# EAGLE schematic 5409057 (EAGLE 6.6.0)

## Sheet 1 of 3
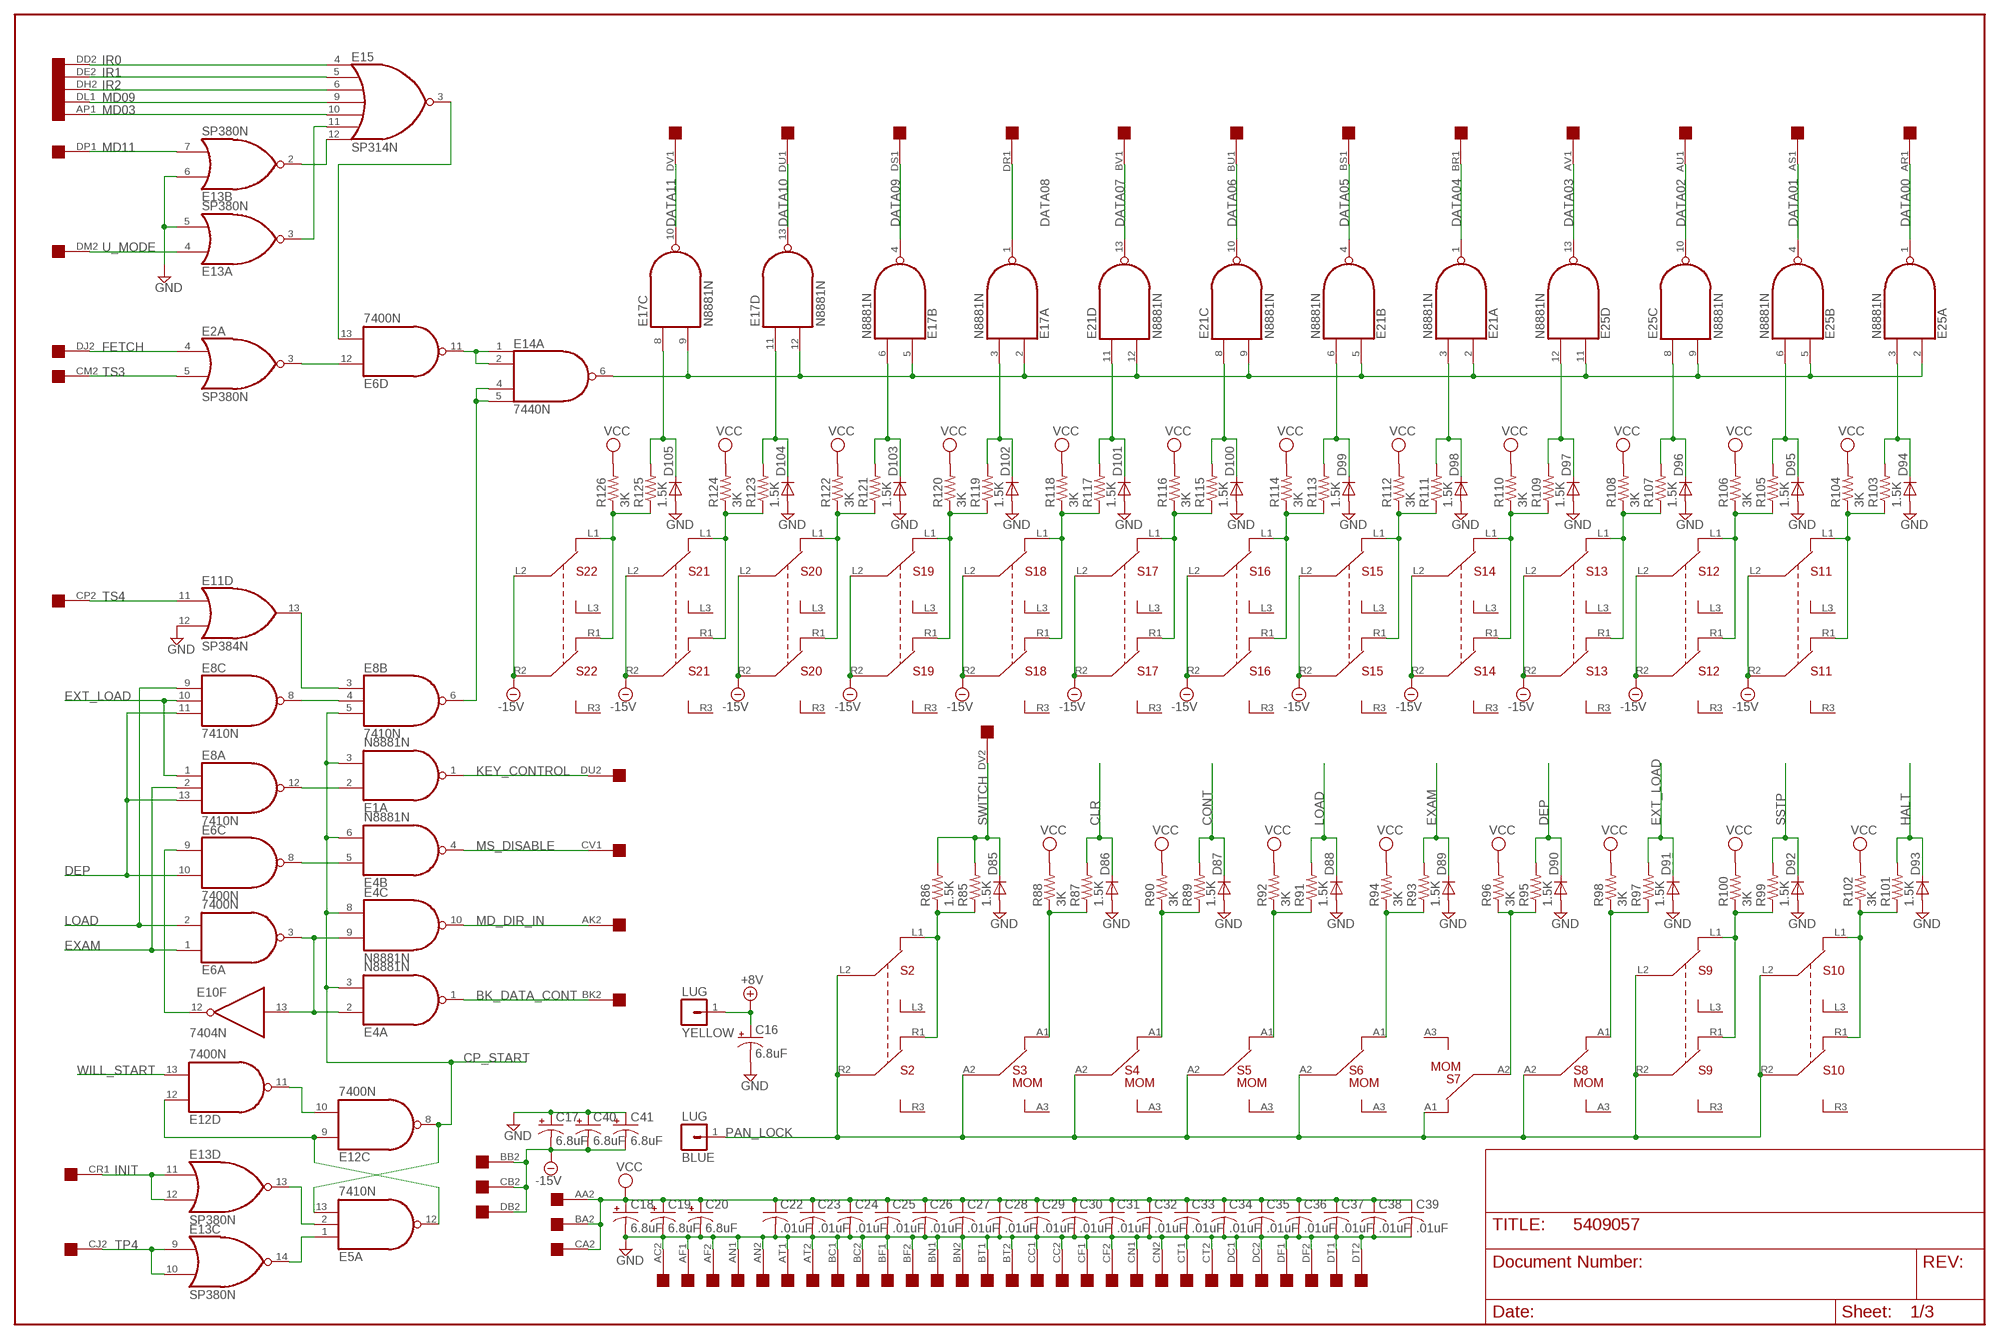
[diagram p0: schematic, sheet 1]

### Parts
BLUE  LUG  [SPADELUG]
C16  6.8uF  CPOL-USE20-8AXIAL  [E12-8]
C17  6.8uF  CPOL-USE20-8AXIAL  [E12-8]
C18  6.8uF  CPOL-USE20-8AXIAL  [E12-8]
C19  6.8uF  CPOL-USE20-8AXIAL  [E12-8]
C20  6.8uF  CPOL-USE20-8AXIAL  [E12-8]
C22  .01uF  C-US050-025X075  [C050-025X075]
C23  .01uF  C-US050-025X075  [C050-025X075]
C24  .01uF  C-US050-025X075  [C050-025X075]
C25  .01uF  C-US050-025X075  [C050-025X075]
C26  .01uF  C-US050-025X075  [C050-025X075]
C27  .01uF  C-US050-025X075  [C050-025X075]
C28  .01uF  C-US050-025X075  [C050-025X075]
C29  .01uF  C-US050-025X075  [C050-025X075]
C30  .01uF  C-US050-025X075  [C050-025X075]
C31  .01uF  C-US050-025X075  [C050-025X075]
C32  .01uF  C-US050-025X075  [C050-025X075]
C33  .01uF  C-US050-025X075  [C050-025X075]
C34  .01uF  C-US050-025X075  [C050-025X075]
C35  .01uF  C-US050-025X075  [C050-025X075]
C36  .01uF  C-US050-025X075  [C050-025X075]
C37  .01uF  C-US050-025X075  [C050-025X075]
C38  .01uF  C-US050-025X075  [C050-025X075]
C39  .01uF  C-US050-025X075  [C050-025X075]
C40  6.8uF  CPOL-USE20-8AXIAL  [E12-8]
C41  6.8uF  CPOL-USE20-8AXIAL  [E12-8]
D85  1N4148  [DO35-10]
D86  1N4148  [DO35-10]
D87  1N4148  [DO35-10]
D88  1N4148  [DO35-10]
D89  1N4148  [DO35-10]
D90  1N4148  [DO35-10]
D91  1N4148  [DO35-10]
D92  1N4148  [DO35-10]
D93  1N4148  [DO35-10]
D94  1N4148  [DO35-10]
D95  1N4148  [DO35-10]
D96  1N4148  [DO35-10]
D97  1N4148  [DO35-10]
D98  1N4148  [DO35-10]
D99  1N4148  [DO35-10]
D100  1N4148  [DO35-10]
D101  1N4148  [DO35-10]
D102  1N4148  [DO35-10]
D103  1N4148  [DO35-10]
D104  1N4148  [DO35-10]
D105  1N4148  [DO35-10]
E1  N8881N  [DIL14]
E2  SP380N  [DIL14]
E4  N8881N  [DIL14]
E5  7410N  [DIL14]
E6  7400N  [DIL14]
E8  7410N  [DIL14]
E10  7404N  [DIL14]
E11  SP384N  [DIL14]
E12  7400N  [DIL14]
E13  SP380N  [DIL14]
E14  7440N  74S20N  [DIL14]
E15  SP314N  [DIL14]
E17  N8881N  [DIL14]
E21  N8881N  [DIL14]
E25  N8881N  [DIL14]
R85  1.5K  R-US_0207/10  [0207/10]
R86  1.5K  R-US_0207/10  [0207/10]
R87  1.5K  R-US_0207/10  [0207/10]
R88  3K  R-US_0207/10  [0207/10]
R89  1.5K  R-US_0207/10  [0207/10]
R90  3K  R-US_0207/10  [0207/10]
R91  1.5K  R-US_0207/10  [0207/10]
R92  3K  R-US_0207/10  [0207/10]
R93  1.5K  R-US_0207/10  [0207/10]
R94  3K  R-US_0207/10  [0207/10]
R95  1.5K  R-US_0207/10  [0207/10]
R96  3K  R-US_0207/10  [0207/10]
R97  1.5K  R-US_0207/10  [0207/10]
R98  3K  R-US_0207/10  [0207/10]
R99  1.5K  R-US_0207/10  [0207/10]
R100  3K  R-US_0207/10  [0207/10]
R101  1.5K  R-US_0207/10  [0207/10]
R102  3K  R-US_0207/10  [0207/10]
R103  1.5K  R-US_0207/10  [0207/10]
R104  3K  R-US_0207/10  [0207/10]
R105  1.5K  R-US_0207/10  [0207/10]
R106  3K  R-US_0207/10  [0207/10]
R107  1.5K  R-US_0207/10  [0207/10]
R108  3K  R-US_0207/10  [0207/10]
R109  1.5K  R-US_0207/10  [0207/10]
R110  3K  R-US_0207/10  [0207/10]
R111  1.5K  R-US_0207/10  [0207/10]
R112  3K  R-US_0207/10  [0207/10]
R113  1.5K  R-US_0207/10  [0207/10]
R114  3K  R-US_0207/10  [0207/10]
R115  1.5K  R-US_0207/10  [0207/10]
R116  3K  R-US_0207/10  [0207/10]
R117  1.5K  R-US_0207/10  [0207/10]
R118  3K  R-US_0207/10  [0207/10]
R119  1.5K  R-US_0207/10  [0207/10]
R120  3K  R-US_0207/10  [0207/10]
R121  1.5K  R-US_0207/10  [0207/10]
R122  3K  R-US_0207/10  [0207/10]
R123  1.5K  R-US_0207/10  [0207/10]
R124  3K  R-US_0207/10  [0207/10]
R125  1.5K  R-US_0207/10  [0207/10]
R126  3K  R-US_0207/10  [0207/10]
S2  DPDT8I  [DPDT8I]
S3  SPDT8I  [SPDT8I]
S4  SPDT8I  [SPDT8I]
S5  SPDT8I  [SPDT8I]
S6  SPDT8I  [SPDT8I]
S7  SPDT8I  [SPDT8I]
S8  SPDT8I  [SPDT8I]
S9  DPDT8I  [DPDT8I]
S10  DPDT8I  [DPDT8I]
S11  DPDT8I  [DPDT8I]
S12  DPDT8I  [DPDT8I]
S13  DPDT8I  [DPDT8I]
S14  DPDT8I  [DPDT8I]
S15  DPDT8I  [DPDT8I]
S16  DPDT8I  [DPDT8I]
S17  DPDT8I  [DPDT8I]
S18  DPDT8I  [DPDT8I]
S19  DPDT8I  [DPDT8I]
S20  DPDT8I  [DPDT8I]
S21  DPDT8I  [DPDT8I]
S22  DPDT8I  [DPDT8I]
U$2  QUAD  [EDGE-CON8]
YELLOW  LUG  [SPADELUG]

### Nets
+8V [Supply]: C16.+ YELLOW.1 ; also sheet 2,3
-15V [Supply]: C17.- C40.- C41.- S11.L2(A2) S11.R2(B2) S12.L2(A2) S12.R2(B2) S13.L2(A2) S13.R2(B2) S14.L2(A2) S14.R2(B2) S15.L2(A2) S15.R2(B2) S16.L2(A2) S16.R2(B2) S17.L2(A2) S17.R2(B2) S18.L2(A2) S18.R2(B2) S19.L2(A2) S19.R2(B2) S20.L2(A2) S20.R2(B2) S21.L2(A2) S21.R2(B2) S22.L2(A2) S22.R2(B2) U$2.BB2 U$2.CB2 U$2.DB2 ; also sheet 2
BK_DATA_CONT: E4.1(A:O) U$2.BK2 ; also sheet 3
CLR: D86.C R87.2 ; also sheet 2
CONT: D87.C R89.2 ; also sheet 2
CP_START: E1.3(A:I1) E4.3(A:I1) E4.6(B:I1) E4.8(C:I0) E5.13(A:I2) E8.5(B:I2) E12.8(C:O) ; also sheet 2
DATA00: E25.1(A:O) U$2.AR1 ; also sheet 3
DATA01: E25.4(B:O) U$2.AS1 ; also sheet 3
DATA02: E25.10(C:O) U$2.AU1 ; also sheet 3
DATA03: E25.13(D:O) U$2.AV1 ; also sheet 3
DATA04: E21.1(A:O) U$2.BR1 ; also sheet 3
DATA05: E21.4(B:O) U$2.BS1 ; also sheet 3
DATA06: E21.10(C:O) U$2.BU1 ; also sheet 3
DATA07: E21.13(D:O) U$2.BV1 ; also sheet 3
DATA08: E17.1(A:O) U$2.DR1 ; also sheet 3
DATA09: E17.4(B:O) U$2.DS1 ; also sheet 3
DATA10: E17.13(D:O) U$2.DU1 ; also sheet 3
DATA11: E17.10(C:O) U$2.DV1 ; also sheet 3
DEP: D90.C E6.10(C:I1) E8.11(C:I2) E8.13(A:I2) R95.2 ; also sheet 2
EXAM: D89.C E6.1(A:I0) E8.2(A:I1) R93.2 ; also sheet 2
EXT_LOAD: D91.C E8.1(A:I0) E8.10(C:I1) R97.2 ; also sheet 2
FETCH: E2.4(A:I0) U$2.DJ2 ; also sheet 3
GND [Supply]: C16.- C17.+ C18.- C19.- C20.- C22.2 C23.2 C24.2 C25.2 C26.2 C27.2 C28.2 C29.2 C30.2 C31.2 C32.2 C33.2 C34.2 C35.2 C36.2 C37.2 C38.2 C39.2 C40.+ C41.+ D85.A D86.A D87.A D88.A D89.A D90.A D91.A D92.A D93.A D94.A D95.A D96.A D97.A D98.A D99.A D100.A D101.A D102.A D103.A D104.A D105.A E11.12(D:I1) E13.5(A:I1) E13.6(B:I0) U$2.AC2 U$2.AF1 U$2.AF2 U$2.AN1 U$2.AN2 U$2.AT1 U$2.AT2 U$2.BC1 U$2.BC2 U$2.BF1 U$2.BF2 U$2.BN1 U$2.BN2 U$2.BT1 U$2.BT2 U$2.CC1 U$2.CC2 U$2.CF1 U$2.CF2 U$2.CN1 U$2.CN2 U$2.CT1 U$2.CT2 U$2.DC1 U$2.DC2 U$2.DF1 U$2.DF2 U$2.DT1 U$2.DT2 ; also sheet 2,3
HALT: D93.C R101.2 ; also sheet 2
INIT: E13.11(D:I0) E13.12(D:I1) U$2.CR1 ; also sheet 2
IR0: E15.4(I0) U$2.DD2 ; also sheet 3
IR1: E15.5(I1) U$2.DE2 ; also sheet 3
IR2: E15.6(I2) U$2.DH2 ; also sheet 3
KEY_CONTROL: E1.1(A:O) U$2.DU2
LOAD: D88.C E6.2(A:I1) E8.9(C:I0) R91.2 ; also sheet 2
MD03: E15.10(I4) U$2.AP1 ; also sheet 3
MD09: E15.9(I3) U$2.DL1 ; also sheet 3
MD11: E13.7(B:I1) U$2.DP1 ; also sheet 3
MD_DIR_IN: E4.10(C:O) U$2.AK2 ; also sheet 3
MS_DISABLE: E4.4(B:O) U$2.CV1
N$1: E13.3(A:O) E15.11(I5)
N$2: E13.2(B:O) E15.12(I6)
N$3: E6.13(D:I1) E15.3(O)
N$4: E2.3(A:O) E6.12(D:I0)
N$5: E6.11(D:O) E14.1(A:I0) E14.2(A:I1)
N$6: E8.3(B:I0) E11.13(D:O)
N$7: E14.6(A:O) E17.2(A:I0) E17.5(B:I0) E17.9(C:I1) E17.12(D:I1) E21.2(A:I0) E21.5(B:I0) E21.9(C:I1) E21.12(D:I1) E25.2(A:I0) E25.5(B:I0) E25.9(C:I1) E25.11(D:I0)
N$8: R125.1 R126.1 S22.L1(A1) S22.R1(B1)
N$9: R121.1 R122.1 S20.L1(A1) S20.R1(B1)
N$10: D105.C E17.8(C:I0) R125.2
N$11: R123.1 R124.1 S21.L1(A1) S21.R1(B1)
N$12: D103.C E17.6(B:I1) R121.2
N$13: R117.1 R118.1 S18.L1(A1) S18.R1(B1)
N$14: D104.C E17.11(D:I0) R123.2
N$15: R119.1 R120.1 S19.L1(A1) S19.R1(B1)
N$16: D101.C E21.11(D:I0) R117.2
N$17: R109.1 R110.1 S14.L1(A1) S14.R1(B1)
N$18: D102.C E17.3(A:I1) R119.2
N$19: R115.1 R116.1 S17.L1(A1) S17.R1(B1)
N$20: D97.C E25.12(D:I1) R109.2
N$21: R85.1 R86.1 S2.L1(A1) S2.R1(B1)
N$22: D100.C E21.8(C:I0) R115.2
N$23: R87.1 R88.1 S3.A1
N$24: R113.1 R114.1 S16.L1(A1) S16.R1(B1)
N$26: D99.C E21.6(B:I1) R113.2
N$27: R89.1 R90.1 S4.A1
N$28: R111.1 R112.1 S15.L1(A1) S15.R1(B1)
N$30: D98.C E21.3(A:I1) R111.2
N$31: R91.1 R92.1 S5.A1
N$32: R107.1 R108.1 S13.L1(A1) S13.R1(B1)
N$33: D96.C E25.8(C:I0) R107.2
N$34: R105.1 R106.1 S12.L1(A1) S12.R1(B1)
N$35: D95.C E25.6(B:I1) R105.2
N$36: R103.1 R104.1 S11.L1(A1) S11.R1(B1)
N$37: D94.C E25.3(A:I1) R103.2
N$38: E8.4(B:I1) E8.8(C:O)
N$39: R93.1 R94.1 S6.A1
N$40: E1.2(A:I0) E8.12(A:O)
N$41: R95.1 R96.1 S7.A2
N$42: E4.5(B:I0) E6.8(C:O)
N$43: R99.1 R100.1 S9.L1(A1) S9.R1(B1)
N$44: E4.2(A:I0) E4.9(C:I1) E6.3(A:O) E10.13(F:I)
N$45: R101.1 R102.1 S10.L1(A1) S10.R1(B1)
N$47: E6.9(C:I0) E10.12(F:O)
N$48: R97.1 R98.1 S8.A1
N$49: E8.6(B:O) E14.4(A:I2) E14.5(A:I3)
N$71: E5.2(A:I1) E13.13(D:O)
N$72: E5.1(A:I0) E13.14(C:O)
N$74: E5.12(A:O) E12.9(C:I0) E12.12(D:I0)
N$75: E12.10(C:I1) E12.11(D:O)
PAN_LOCK [Supply]: BLUE.1 S2.L2(A2) S2.R2(B2) S3.A2 S4.A2 S5.A2 S6.A2 S7.A1 S8.A2 S9.L2(A2) S9.R2(B2) S10.L2(A2) S10.R2(B2)
SSTP: D92.C R99.2 ; also sheet 2
SWITCH: D85.C R85.2 R86.2 U$2.DV2 ; also sheet 3
TP4: E13.9(C:I0) E13.10(C:I1) U$2.CJ2
TS3: E2.5(A:I1) U$2.CM2
TS4: E11.11(D:I0) U$2.CP2
U_MODE: E13.4(A:I0) U$2.DM2
VCC [Supply]: C18.+ C19.+ C20.+ C22.1 C23.1 C24.1 C25.1 C26.1 C27.1 C28.1 C29.1 C30.1 C31.1 C32.1 C33.1 C34.1 C35.1 C36.1 C37.1 C38.1 C39.1 R88.2 R90.2 R92.2 R94.2 R96.2 R98.2 R100.2 R102.2 R104.2 R106.2 R108.2 R110.2 R112.2 R114.2 R116.2 R118.2 R120.2 R122.2 R124.2 R126.2 U$2.AA2 U$2.BA2 U$2.CA2 ; also sheet 2,3
WILL_START: E12.13(D:I1) ; also sheet 2
Unconnected: E1.4(B:O) E1.5(B:I0) E1.6(B:I1) E1.8(C:I0) E1.9(C:I1) E1.10(C:O) E11.3(A:O) E11.4(A:I0) E11.5(A:I1) S2.L3(A3) S2.R3(B3) S3.A3 S4.A3 S5.A3 S6.A3 S7.A3 S8.A3 S9.L3(A3) S9.R3(B3) S10.L3(A3) S10.R3(B3) S11.L3(A3) S11.R3(B3) S12.L3(A3) S12.R3(B3) S13.L3(A3) S13.R3(B3) S14.L3(A3) S14.R3(B3) S15.L3(A3) S15.R3(B3) S16.L3(A3) S16.R3(B3) S17.L3(A3) S17.R3(B3) S18.L3(A3) S18.R3(B3) S19.L3(A3) S19.R3(B3) S20.L3(A3) S20.R3(B3) S21.L3(A3) S21.R3(B3) S22.L3(A3) S22.R3(B3) U$2.AA1 U$2.AB1 U$2.AB2 U$2.AC1 U$2.AL2 U$2.AM2 U$2.AP2 U$2.AR2 U$2.AS2 U$2.AU2 U$2.AV2 U$2.BA1 U$2.BB1 U$2.BD2 U$2.BH2 U$2.BJ2 U$2.BP2 U$2.BR2 U$2.BS2 U$2.BV2 U$2.CA1 U$2.CB1 U$2.CD2 U$2.CE1 U$2.CE2 U$2.CH1 U$2.CH2 U$2.CJ1 U$2.CK1 U$2.CL1 U$2.CL2 U$2.CM1 U$2.CP1 U$2.CR2 U$2.CS1 U$2.CS2 U$2.CU1 U$2.DA1 U$2.DA2 U$2.DB1 U$2.DN1 U$2.DN2

## Sheet 2 of 3
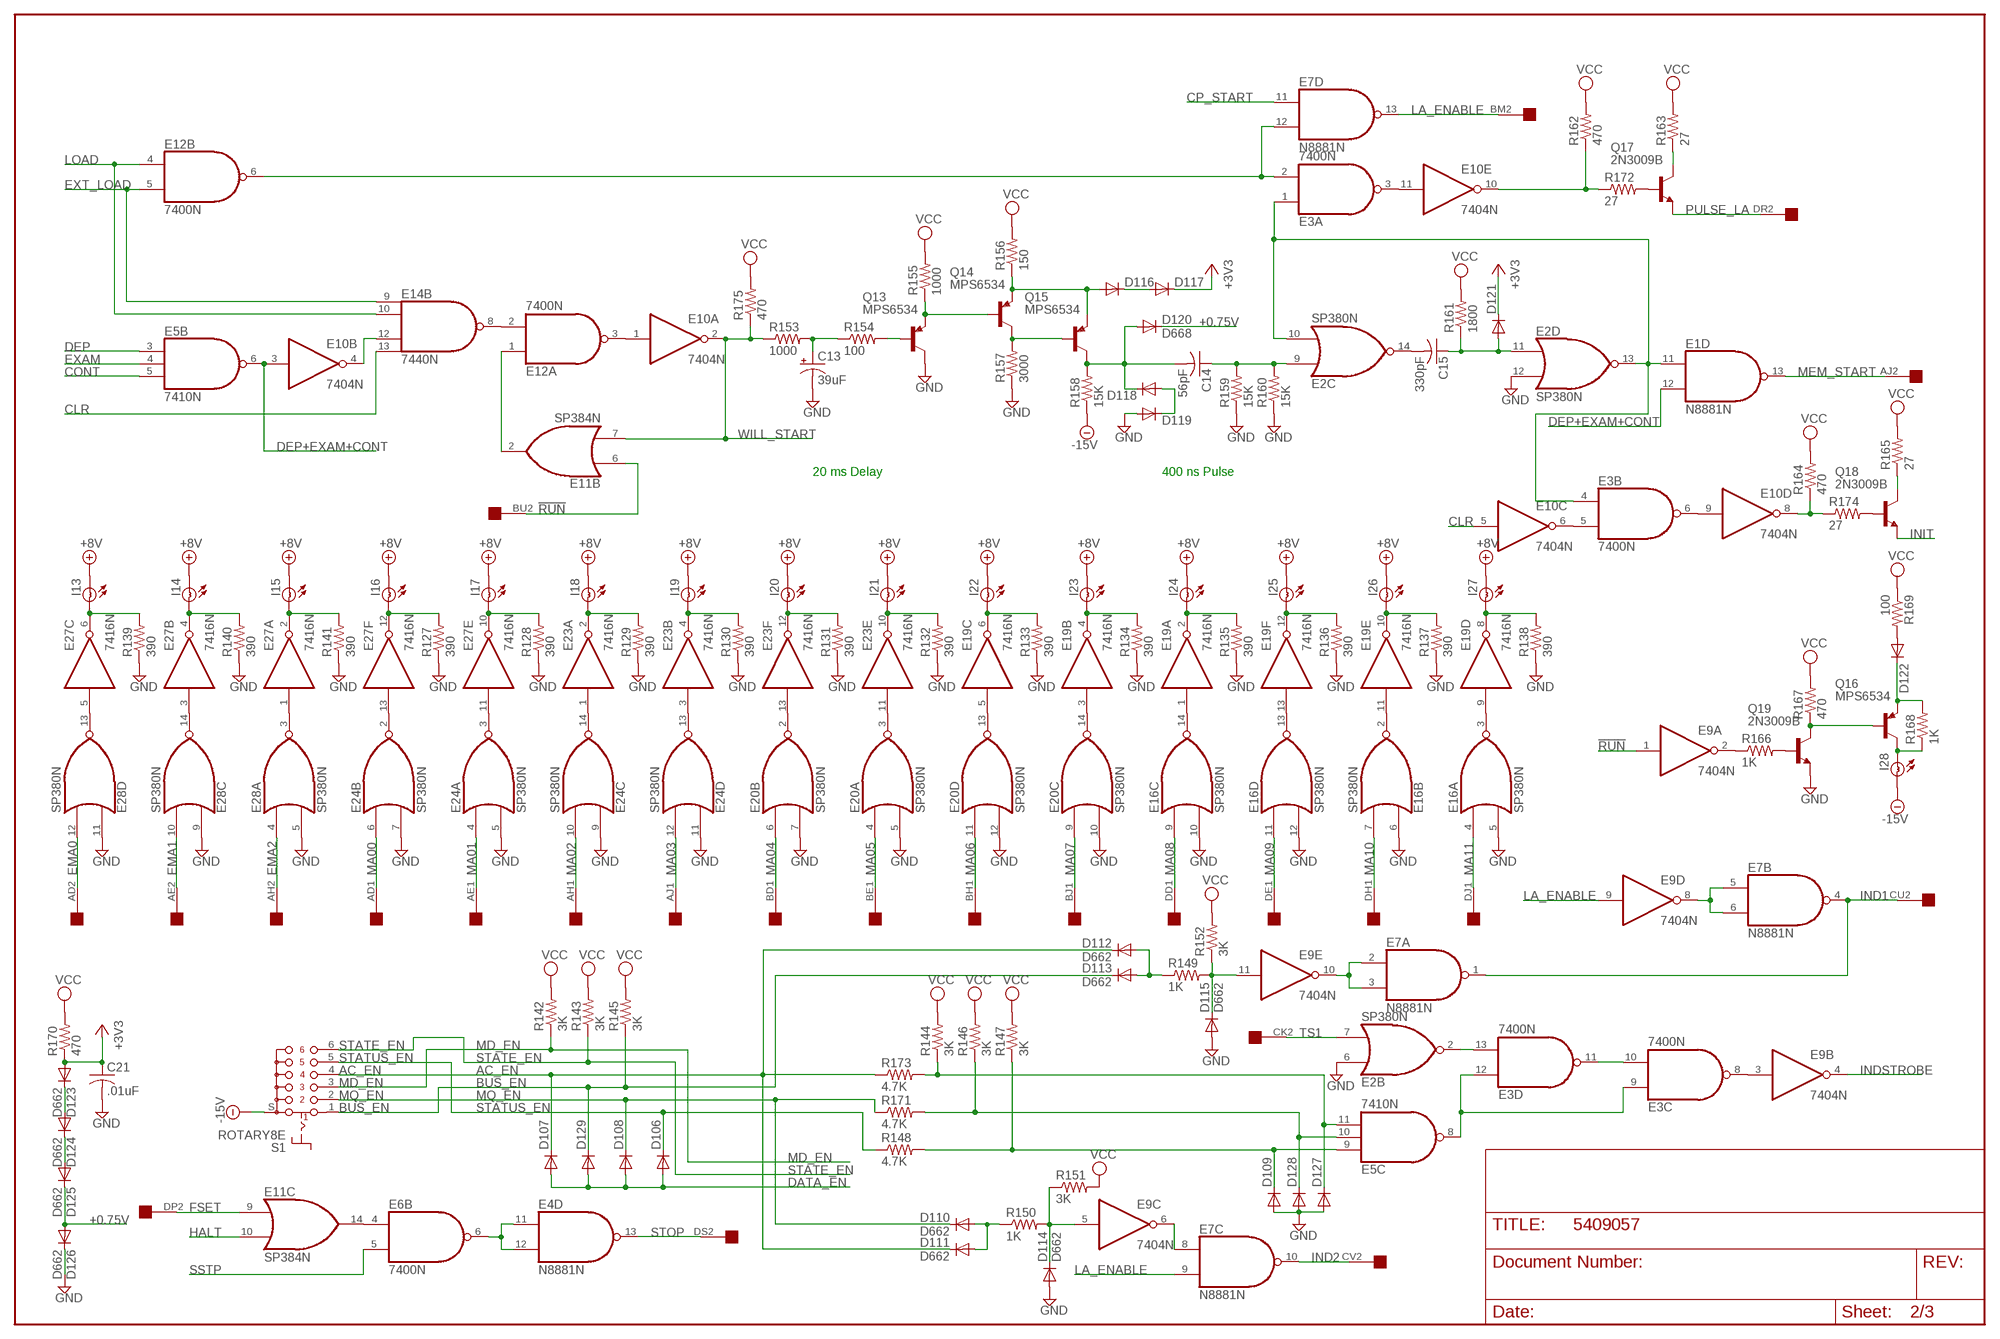
[diagram p1: schematic, sheet 2]

### Parts
C13  39uF  CPOL-USE20-8AXIAL  [E12-8]
C14  56pF  C-US050-025X075  [C050-025X075]
C15  330pF  C-US050-025X075  [C050-025X075]
C21  .01uF  C-US050-025X075  [C050-025X075]
D106  1N4148  [DO35-10]
D107  1N4148  [DO35-10]
D108  1N4148  [DO35-10]
D109  1N4148  [DO35-10]
D110  D662  1N4148  [DO35-10]
D111  D662  1N4148  [DO35-10]
D112  D662  1N4148  [DO35-10]
D113  D662  1N4148  [DO35-10]
D114  D662  1N4148  [DO35-10]
D115  D662  1N4148  [DO35-10]
D116  1N4148  [DO35-10]
D117  1N4148  [DO35-10]
D118  1N4148  [DO35-10]
D119  1N4148  [DO35-10]
D120  D668  1N4148  [DO35-10]
D121  1N4148  [DO35-10]
D122  1N4148  [DO35-10]
D123  D662  1N4148  [DO35-10]
D124  D662  1N4148  [DO35-10]
D125  D662  1N4148  [DO35-10]
D126  D662  1N4148  [DO35-10]
D127  1N4148  [DO35-10]
D128  1N4148  [DO35-10]
D129  1N4148  [DO35-10]
E3  7400N  [DIL14]
E7  N8881N  [DIL14]
E9  7404N  [DIL14]
E16  SP380N  [DIL14]
E19  7416N  [DIL14]
E20  SP380N  [DIL14]
E23  7416N  [DIL14]
E24  SP380N  [DIL14]
E27  7416N  [DIL14]
E28  SP380N  [DIL14]
I13  BULB  [BULB]
I14  BULB  [BULB]
I15  BULB  [BULB]
I16  BULB  [BULB]
I17  BULB  [BULB]
I18  BULB  [BULB]
I19  BULB  [BULB]
I20  BULB  [BULB]
I21  BULB  [BULB]
I22  BULB  [BULB]
I23  BULB  [BULB]
I24  BULB  [BULB]
I25  BULB  [BULB]
I26  BULB  [BULB]
I27  BULB  [BULB]
I28  BULB  [BULB]
Q13  MPS6534  2N3637  [TO39]
Q14  MPS6534  2N3637  [TO39]
Q15  MPS6534  2N3637  [TO39]
Q16  MPS6534  2N3637  [TO39]
Q17  2N3009B  2N3019  [TO39]
Q18  2N3009B  2N3019  [TO39]
Q19  2N3009B  2N3019  [TO39]
R127  390  R-US_0207/10  [0207/10]
R128  390  R-US_0207/10  [0207/10]
R129  390  R-US_0207/10  [0207/10]
R130  390  R-US_0207/10  [0207/10]
R131  390  R-US_0207/10  [0207/10]
R132  390  R-US_0207/10  [0207/10]
R133  390  R-US_0207/10  [0207/10]
R134  390  R-US_0207/10  [0207/10]
R135  390  R-US_0207/10  [0207/10]
R136  390  R-US_0207/10  [0207/10]
R137  390  R-US_0207/10  [0207/10]
R138  390  R-US_0207/10  [0207/10]
R139  390  R-US_0207/10  [0207/10]
R140  390  R-US_0207/10  [0207/10]
R141  390  R-US_0207/10  [0207/10]
R142  3K  R-US_0207/10  [0207/10]
R143  3K  R-US_0207/10  [0207/10]
R144  3K  R-US_0207/10  [0207/10]
R145  3K  R-US_0207/10  [0207/10]
R146  3K  R-US_0207/10  [0207/10]
R147  3K  R-US_0207/10  [0207/10]
R148  4.7K  R-US_0207/10  [0207/10]
R149  1K  R-US_0207/10  [0207/10]
R150  1K  R-US_0207/10  [0207/10]
R151  3K  R-US_0207/10  [0207/10]
R152  3K  R-US_0207/10  [0207/10]
R153  1000  R-US_0207/10  [0207/10]
R154  100  R-US_0207/10  [0207/10]
R155  1000  R-US_0207/10  [0207/10]
R156  150  R-US_0207/10  [0207/10]
R157  3000  R-US_0207/10  [0207/10]
R158  15K  R-US_0207/10  [0207/10]
R159  15K  R-US_0207/10  [0207/10]
R160  15K  R-US_0207/10  [0207/10]
R161  1800  R-US_0207/10  [0207/10]
R162  470  R-US_0207/10  [0207/10]
R163  27  R-US_0207/10  [0207/10]
R164  470  R-US_0207/10  [0207/10]
R165  27  R-US_0207/10  [0207/10]
R166  1K  R-US_0207/10  [0207/10]
R167  470  R-US_0207/10  [0207/10]
R168  1K  R-US_0207/10  [0207/10]
R169  100  R-US_0207/10  [0207/10]
R170  470  R-US_0207/10  [0207/10]
R171  4.7K  R-US_0207/10  [0207/10]
R172  27  R-US_0207/10  [0207/10]
R173  4.7K  R-US_0207/10  [0207/10]
R174  27  R-US_0207/10  [0207/10]
R175  470  R-US_0204/7  [0204/7]
S1  ROTARY8E  [ROTARY-8E]

### Nets
!RUN: E9.1(A:I) E11.6(B:I0) U$2.BU2
+0.75V [Supply]: D120.C D125.C D126.A
+3V3: C21.1 D117.C D121.C D123.A R170.1
+8V [Supply]: I13.B I14.B I15.B I16.B I17.B I18.B I19.B I20.B I21.B I22.B I23.B I24.B I25.B I26.B I27.B ; also sheet 1,3
-15V [Supply]: I28.A R158.1 S1.S ; also sheet 1
AC_EN: D107.C D111.C D112.C R173.1 S1.4
BUS_EN: D113.C D129.C R145.1 S1.1
CLR: E10.5(C:I) E14.13(B:I3) ; also sheet 1
CONT: E5.5(B:I2) ; also sheet 1
CP_START: E7.11(D:I0) ; also sheet 1
DATA_EN: D106.A D107.A D108.A D129.A ; also sheet 3
DEP: E5.3(B:I0) ; also sheet 1
DEP+EXAM+CONT: E1.12(D:I1) E5.6(B:O) E10.3(B:I)
EMA0: E28.12(D:I1) U$2.AD2
EMA1: E28.10(C:I1) U$2.AE2
EMA2: E28.4(A:I0) U$2.AH2
EXAM: E5.4(B:I1) ; also sheet 1
EXT_LOAD: E12.5(B:I1) E14.9(B:I0) ; also sheet 1
FSET: E11.9(C:I0) U$2.DP2
GND [Supply]: C13.- C21.2 D109.A D114.A D115.A D119.A D126.C D127.A D128.A E2.6(B:I0) E2.12(D:I1) E16.5(A:I1) E16.6(B:I0) E16.10(C:I1) E16.12(D:I1) E20.5(A:I1) E20.7(B:I1) E20.10(C:I1) E20.12(D:I1) E24.5(A:I1) E24.7(B:I1) E24.9(C:I0) E24.11(D:I0) E28.5(A:I1) E28.9(C:I0) E28.11(D:I0) Q13.3(C) Q19.1(E) R127.1 R128.1 R129.1 R130.1 R131.1 R132.1 R133.1 R134.1 R135.1 R136.1 R137.1 R138.1 R139.1 R140.1 R141.1 R157.1 R159.1 R160.1 ; also sheet 1,3
HALT: E11.10(C:I1) ; also sheet 1
IND1: E7.1(A:O) E7.4(B:O) U$2.CU2
IND2: E7.10(C:O) U$2.CV2
INDSTROBE: E9.4(B:O) ; also sheet 3
INIT: Q18.1(E) ; also sheet 1
LA_ENABLE: E7.9(C:I1) E7.13(D:O) E9.9(D:I) U$2.BM2
LOAD: E12.4(B:I0) E14.10(B:I1) ; also sheet 1
MA00: E24.6(B:I0) U$2.AD1
MA01: E24.4(A:I0) U$2.AE1
MA02: E24.10(C:I1) U$2.AH1
MA03: E24.12(D:I1) U$2.AJ1
MA04: E20.6(B:I0) U$2.BD1
MA05: E20.4(A:I0) U$2.BE1
MA06: E20.11(D:I0) U$2.BH1
MA07: E20.9(C:I0) U$2.BJ1
MA08: E16.9(C:I0) U$2.DD1
MA09: E16.11(D:I0) U$2.DE1
MA10: E16.7(B:I1) U$2.DH1
MA11: E16.4(A:I0) U$2.DJ1
MD_EN: R142.1 S1.3 ; also sheet 3
MEM_START: E1.13(D:O) U$2.AJ2
MQ_EN: D108.C D110.C R171.1 S1.2
N$25: E27.10(E:O) I17.A R128.2
N$29: E10.4(B:O) E14.12(B:I2)
N$50: E12.2(A:I1) E14.8(B:O)
N$51: E10.1(A:I) E12.3(A:O)
N$52: E11.2(B:O) E12.1(A:I0)
N$54: C13.+ R153.2 R154.1
N$55: Q13.2(B) R154.2
N$56: Q13.1(E) Q14.2(B) R155.1
N$57: D116.A Q14.1(E) Q15.1(E) R156.1
N$58: Q14.3(C) Q15.2(B) R157.2
N$59: C14.2 D118.C D120.A Q15.3(C) R158.2
N$60: D116.C D117.A
N$61: C14.1 E2.9(C:I0) R159.2 R160.2
N$62: D118.A D119.C
N$63: C15.2 E2.14(C:O)
N$64: C15.1 D121.A E2.11(D:I0) R161.1
N$65: E1.11(D:I0) E2.10(C:I1) E2.13(D:O) E3.1(A:I0) E3.4(B:I0)
N$66: E3.2(A:I1) E7.12(D:I1) E12.6(B:O)
N$67: E3.3(A:O) E10.11(E:I)
N$68: Q17.2(B) R172.2
N$69: Q17.3(C) R163.1
N$70: E10.10(E:O) R162.1 R172.1
N$122: D127.C E5.11(C:I2) R144.1 R173.2
N$147: E27.6(C:O) I13.A R139.2
N$172: E27.5(C:I) E28.13(D:O)
N$173: E27.4(B:O) I14.A R140.2
N$174: E27.2(A:O) I15.A R141.2
N$175: E27.12(F:O) I16.A R127.2
N$176: E27.3(B:I) E28.14(C:O)
N$177: E27.1(A:I) E28.3(A:O)
N$178: E24.2(B:O) E27.13(F:I)
N$179: E6.4(B:I0) E11.14(C:O)
N$180: E23.2(A:O) I18.A R129.2
N$181: E23.4(B:O) I19.A R130.2
N$182: E23.12(F:O) I20.A R131.2
N$183: E23.10(E:O) I21.A R132.2
N$184: E19.6(C:O) I22.A R133.2
N$185: E19.4(B:O) I23.A R134.2
N$186: E19.2(A:O) I24.A R135.2
N$187: E24.3(A:O) E27.11(E:I)
N$188: E23.1(A:I) E24.14(C:O)
N$189: E23.3(B:I) E24.13(D:O)
N$190: E19.12(F:O) I25.A R136.2
N$191: E19.10(E:O) I26.A R137.2
N$192: E19.8(D:O) I27.A R138.2
N$193: Q18.3(C) R165.1
N$194: E20.2(B:O) E23.13(F:I)
N$195: E20.3(A:O) E23.11(E:I)
N$196: E19.5(C:I) E20.13(D:O)
N$197: E19.3(B:I) E20.14(C:O)
N$198: E16.14(C:O) E19.1(A:I)
N$199: E16.13(D:O) E19.13(F:I)
N$200: E16.2(B:O) E19.11(E:I)
N$201: E16.3(A:O) E19.9(D:I)
N$202: E2.2(B:O) E3.13(D:I1)
N$203: E3.9(C:I0) E3.12(D:I0) E5.8(C:O)
N$204: E3.10(C:I1) E3.11(D:O)
N$205: E3.8(C:O) E9.3(B:I)
N$206: E3.6(B:O) E10.9(D:I)
N$207: E4.11(D:I0) E4.12(D:I1) E6.6(B:O)
N$209: E7.5(B:I0) E7.6(B:I1) E9.8(D:O)
N$210: E7.2(A:I0) E7.3(A:I1) E9.10(E:O)
N$211: E7.8(C:I0) E9.6(C:O)
N$212: E3.5(B:I1) E10.6(C:O)
N$213: E9.2(A:O) R166.1
N$214: D124.C D125.A
N$215 [Supply]: D123.C D124.A
N$216: Q19.2(B) R166.2
N$217: Q16.2(B) Q19.3(C) R167.1
N$218: D122.A R169.2
N$219: D122.C Q16.1(E) R168.2
N$220: I28.B Q16.3(C) R168.1
N$221: E10.8(D:O) R164.1 R174.1
N$222: Q18.2(B) R174.2
N$223: D110.A D111.A R150.1
N$224: D114.C E9.5(C:I) R150.2 R151.1
N$225: D112.A D113.A R149.1
N$226: D115.C E9.11(E:I) R149.2 R152.1
N$228: D128.C E5.10(C:I1) R146.1 R171.2
N$229: D109.C E5.9(C:I0) R147.1 R148.2
PULSE_LA: Q17.1(E) U$2.DR2
SSTP: E6.5(B:I1) ; also sheet 1
STATE_EN: R143.1 S1.6 ; also sheet 3
STATUS_EN: D106.C R148.1 S1.5
STOP: E4.13(D:O) U$2.DS2
TS1: E2.7(B:I1) U$2.CK2
VCC [Supply]: R142.2 R143.2 R144.2 R145.2 R146.2 R147.2 R151.2 R152.2 R155.2 R156.2 R161.2 R162.2 R163.2 R164.2 R165.2 R167.2 R169.1 R170.2 R175.2 ; also sheet 1,3
WILL_START: E10.2(A:O) E11.7(B:I1) R153.1 R175.1 ; also sheet 1
Unconnected: E9.12(F:O) E9.13(F:I) E23.5(C:I) E23.6(C:O) E23.8(D:O) E23.9(D:I) E27.8(D:O) E27.9(D:I) E28.2(B:O) E28.6(B:I0) E28.7(B:I1)

### Notes on the sheet
- 20 ms Delay | 400 ns Pulse

## Sheet 3 of 3
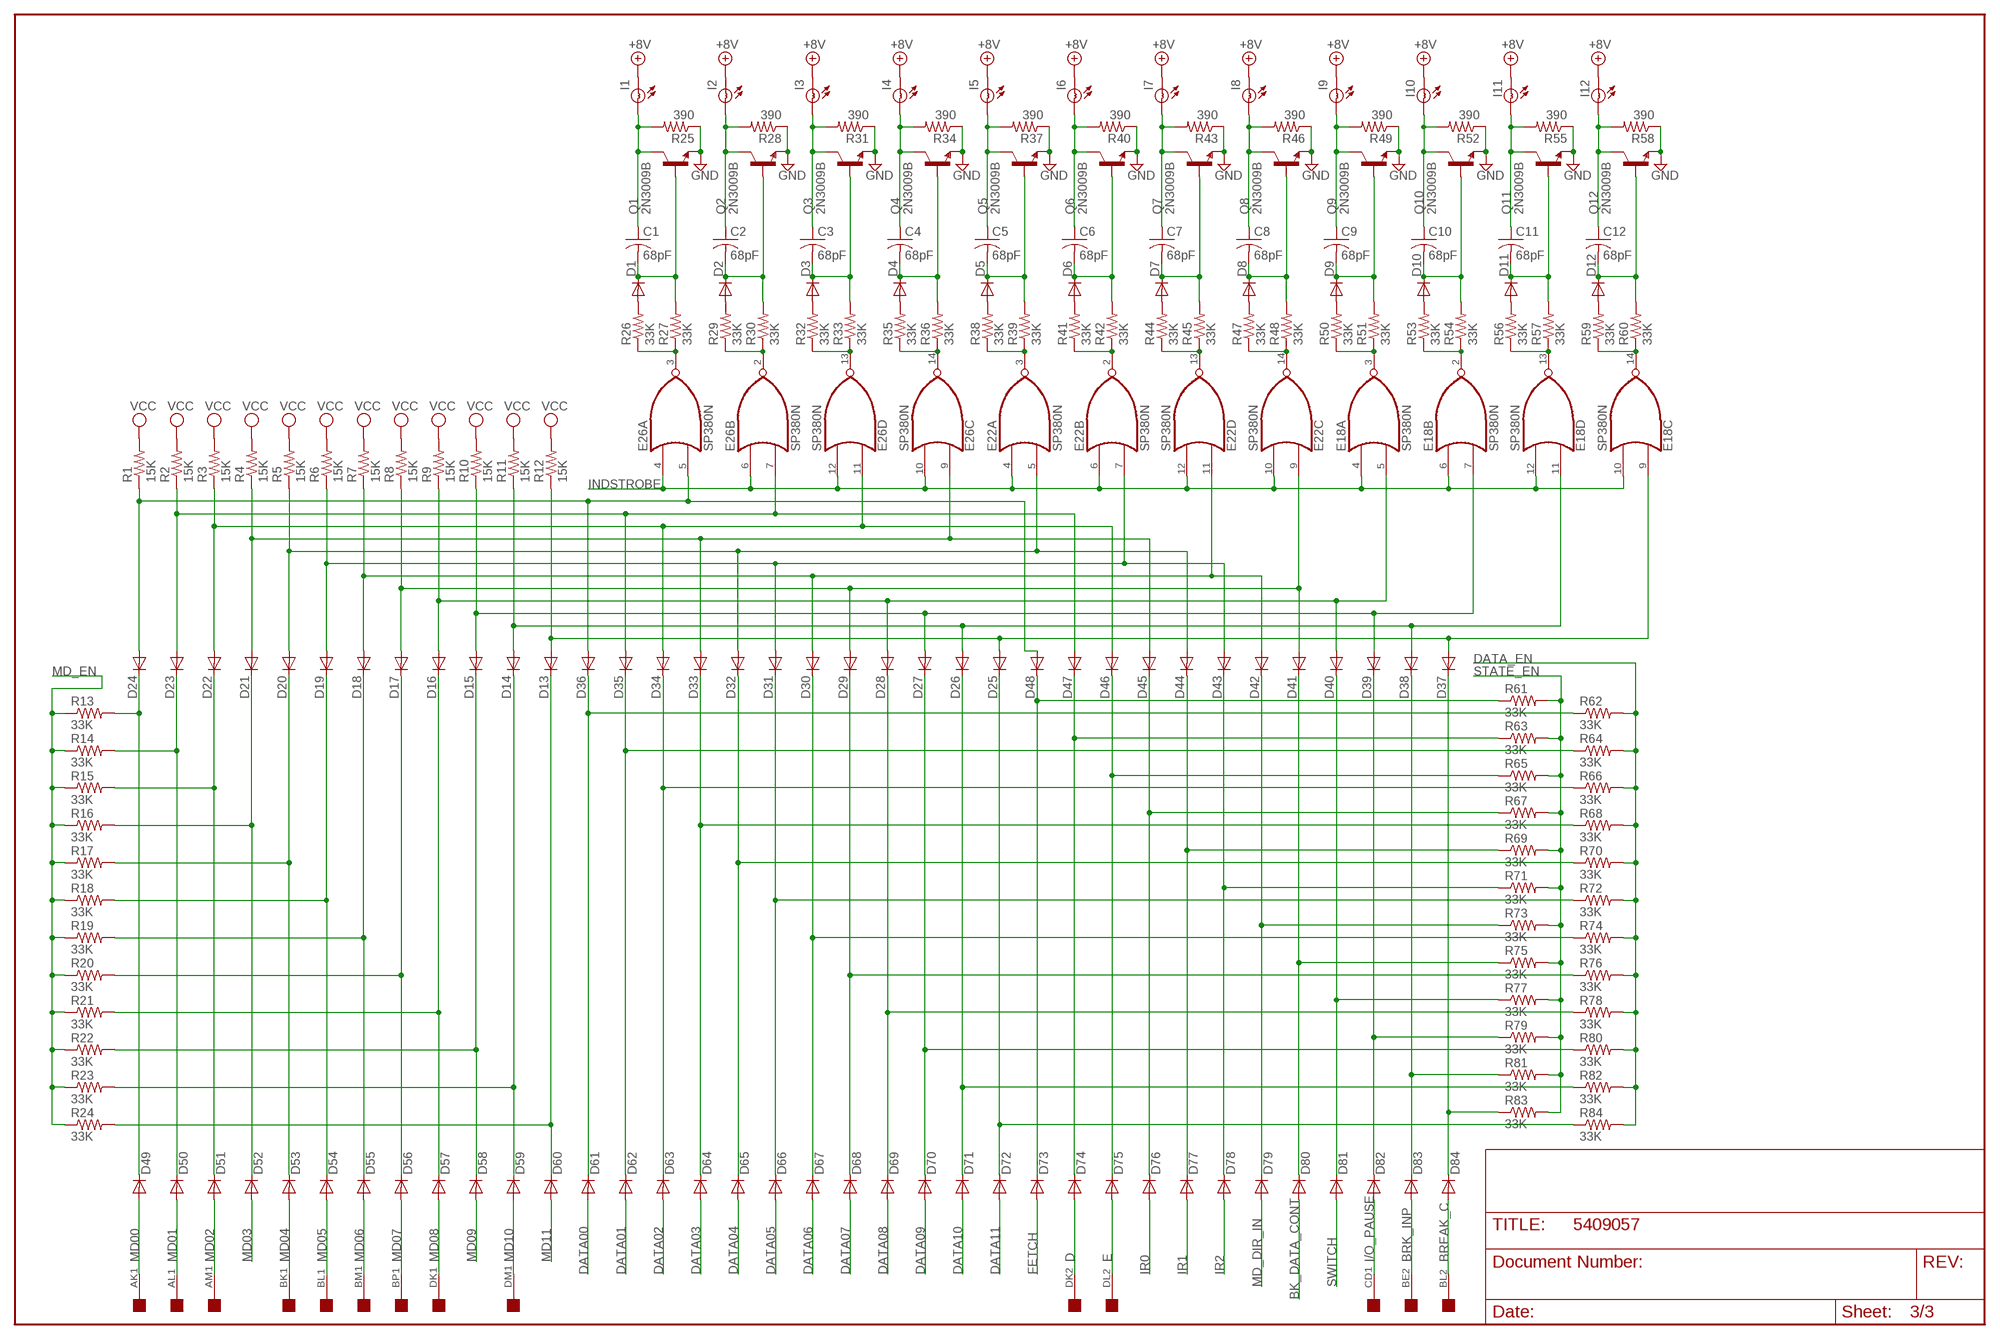
[diagram p2: schematic, sheet 3]

### Parts
C1  68pF  C-US050-025X075  [C050-025X075]
C2  68pF  C-US050-025X075  [C050-025X075]
C3  68pF  C-US050-025X075  [C050-025X075]
C4  68pF  C-US050-025X075  [C050-025X075]
C5  68pF  C-US050-025X075  [C050-025X075]
C6  68pF  C-US050-025X075  [C050-025X075]
C7  68pF  C-US050-025X075  [C050-025X075]
C8  68pF  C-US050-025X075  [C050-025X075]
C9  68pF  C-US050-025X075  [C050-025X075]
C10  68pF  C-US050-025X075  [C050-025X075]
C11  68pF  C-US050-025X075  [C050-025X075]
C12  68pF  C-US050-025X075  [C050-025X075]
D1  1N4148  [DO35-10]
D2  1N4148  [DO35-10]
D3  1N4148  [DO35-10]
D4  1N4148  [DO35-10]
D5  1N4148  [DO35-10]
D6  1N4148  [DO35-10]
D7  1N4148  [DO35-10]
D8  1N4148  [DO35-10]
D9  1N4148  [DO35-10]
D10  1N4148  [DO35-10]
D11  1N4148  [DO35-10]
D12  1N4148  [DO35-10]
D13  1N4148  [DO35-10]
D14  1N4148  [DO35-10]
D15  1N4148  [DO35-10]
D16  1N4148  [DO35-10]
D17  1N4148  [DO35-10]
D18  1N4148  [DO35-10]
D19  1N4148  [DO35-10]
D20  1N4148  [DO35-10]
D21  1N4148  [DO35-10]
D22  1N4148  [DO35-10]
D23  1N4148  [DO35-10]
D24  1N4148  [DO35-10]
D25  1N4148  [DO35-10]
D26  1N4148  [DO35-10]
D27  1N4148  [DO35-10]
D28  1N4148  [DO35-10]
D29  1N4148  [DO35-10]
D30  1N4148  [DO35-10]
D31  1N4148  [DO35-10]
D32  1N4148  [DO35-10]
D33  1N4148  [DO35-10]
D34  1N4148  [DO35-10]
D35  1N4148  [DO35-10]
D36  1N4148  [DO35-10]
D37  1N4148  [DO35-10]
D38  1N4148  [DO35-10]
D39  1N4148  [DO35-10]
D40  1N4148  [DO35-10]
D41  1N4148  [DO35-10]
D42  1N4148  [DO35-10]
D43  1N4148  [DO35-10]
D44  1N4148  [DO35-10]
D45  1N4148  [DO35-10]
D46  1N4148  [DO35-10]
D47  1N4148  [DO35-10]
D48  1N4148  [DO35-10]
D49  1N4148  [DO35-10]
D50  1N4148  [DO35-10]
D51  1N4148  [DO35-10]
D52  1N4148  [DO35-10]
D53  1N4148  [DO35-10]
D54  1N4148  [DO35-10]
D55  1N4148  [DO35-10]
D56  1N4148  [DO35-10]
D57  1N4148  [DO35-10]
D58  1N4148  [DO35-10]
D59  1N4148  [DO35-10]
D60  1N4148  [DO35-10]
D61  1N4148  [DO35-10]
D62  1N4148  [DO35-10]
D63  1N4148  [DO35-10]
D64  1N4148  [DO35-10]
D65  1N4148  [DO35-10]
D66  1N4148  [DO35-10]
D67  1N4148  [DO35-10]
D68  1N4148  [DO35-10]
D69  1N4148  [DO35-10]
D70  1N4148  [DO35-10]
D71  1N4148  [DO35-10]
D72  1N4148  [DO35-10]
D73  1N4148  [DO35-10]
D74  1N4148  [DO35-10]
D75  1N4148  [DO35-10]
D76  1N4148  [DO35-10]
D77  1N4148  [DO35-10]
D78  1N4148  [DO35-10]
D79  1N4148  [DO35-10]
D80  1N4148  [DO35-10]
D81  1N4148  [DO35-10]
D82  1N4148  [DO35-10]
D83  1N4148  [DO35-10]
D84  1N4148  [DO35-10]
E18  SP380N  [DIL14]
E22  SP380N  [DIL14]
E26  SP380N  [DIL14]
I1  BULB  [BULB]
I2  BULB  [BULB]
I3  BULB  [BULB]
I4  BULB  [BULB]
I5  BULB  [BULB]
I6  BULB  [BULB]
I7  BULB  [BULB]
I8  BULB  [BULB]
I9  BULB  [BULB]
I10  BULB  [BULB]
I11  BULB  [BULB]
I12  BULB  [BULB]
Q1  2N3009B  2N3019  [TO39]
Q2  2N3009B  2N3019  [TO39]
Q3  2N3009B  2N3019  [TO39]
Q4  2N3009B  2N3019  [TO39]
Q5  2N3009B  2N3019  [TO39]
Q6  2N3009B  2N3019  [TO39]
Q7  2N3009B  2N3019  [TO39]
Q8  2N3009B  2N3019  [TO39]
Q9  2N3009B  2N3019  [TO39]
Q10  2N3009B  2N3019  [TO39]
Q11  2N3009B  2N3019  [TO39]
Q12  2N3009B  2N3019  [TO39]
R1  15K  R-US_0207/10  [0207/10]
R2  15K  R-US_0207/10  [0207/10]
R3  15K  R-US_0207/10  [0207/10]
R4  15K  R-US_0207/10  [0207/10]
R5  15K  R-US_0207/10  [0207/10]
R6  15K  R-US_0207/10  [0207/10]
R7  15K  R-US_0207/10  [0207/10]
R8  15K  R-US_0207/10  [0207/10]
R9  15K  R-US_0207/10  [0207/10]
R10  15K  R-US_0207/10  [0207/10]
R11  15K  R-US_0207/10  [0207/10]
R12  15K  R-US_0207/10  [0207/10]
R13  33K  R-US_0207/10  [0207/10]
R14  33K  R-US_0207/10  [0207/10]
R15  33K  R-US_0207/10  [0207/10]
R16  33K  R-US_0207/10  [0207/10]
R17  33K  R-US_0207/10  [0207/10]
R18  33K  R-US_0207/10  [0207/10]
R19  33K  R-US_0207/10  [0207/10]
R20  33K  R-US_0207/10  [0207/10]
R21  33K  R-US_0207/10  [0207/10]
R22  33K  R-US_0207/10  [0207/10]
R23  33K  R-US_0207/10  [0207/10]
R24  33K  R-US_0207/10  [0207/10]
R25  390  R-US_0207/10  [0207/10]
R26  33K  R-US_0207/10  [0207/10]
R27  33K  R-US_0207/10  [0207/10]
R28  390  R-US_0207/10  [0207/10]
R29  33K  R-US_0207/10  [0207/10]
R30  33K  R-US_0207/10  [0207/10]
R31  390  R-US_0207/10  [0207/10]
R32  33K  R-US_0207/10  [0207/10]
R33  33K  R-US_0207/10  [0207/10]
R34  390  R-US_0207/10  [0207/10]
R35  33K  R-US_0207/10  [0207/10]
R36  33K  R-US_0207/10  [0207/10]
R37  390  R-US_0207/10  [0207/10]
R38  33K  R-US_0207/10  [0207/10]
R39  33K  R-US_0207/10  [0207/10]
R40  390  R-US_0207/10  [0207/10]
R41  33K  R-US_0207/10  [0207/10]
R42  33K  R-US_0207/10  [0207/10]
R43  390  R-US_0207/10  [0207/10]
R44  33K  R-US_0207/10  [0207/10]
R45  33K  R-US_0207/10  [0207/10]
R46  390  R-US_0207/10  [0207/10]
R47  33K  R-US_0207/10  [0207/10]
R48  33K  R-US_0207/10  [0207/10]
R49  390  R-US_0207/10  [0207/10]
R50  33K  R-US_0207/10  [0207/10]
R51  33K  R-US_0207/10  [0207/10]
R52  390  R-US_0207/10  [0207/10]
R53  33K  R-US_0207/10  [0207/10]
R54  33K  R-US_0207/10  [0207/10]
R55  390  R-US_0207/10  [0207/10]
R56  33K  R-US_0207/10  [0207/10]
R57  33K  R-US_0207/10  [0207/10]
R58  390  R-US_0207/10  [0207/10]
R59  33K  R-US_0207/10  [0207/10]
R60  33K  R-US_0207/10  [0207/10]
R61  33K  R-US_0207/10  [0207/10]
R62  33K  R-US_0207/10  [0207/10]
R63  33K  R-US_0207/10  [0207/10]
R64  33K  R-US_0207/10  [0207/10]
R65  33K  R-US_0207/10  [0207/10]
R66  33K  R-US_0207/10  [0207/10]
R67  33K  R-US_0207/10  [0207/10]
R68  33K  R-US_0207/10  [0207/10]
R69  33K  R-US_0207/10  [0207/10]
R70  33K  R-US_0207/10  [0207/10]
R71  33K  R-US_0207/10  [0207/10]
R72  33K  R-US_0207/10  [0207/10]
R73  33K  R-US_0207/10  [0207/10]
R74  33K  R-US_0207/10  [0207/10]
R75  33K  R-US_0207/10  [0207/10]
R76  33K  R-US_0207/10  [0207/10]
R77  33K  R-US_0207/10  [0207/10]
R78  33K  R-US_0207/10  [0207/10]
R79  33K  R-US_0207/10  [0207/10]
R80  33K  R-US_0207/10  [0207/10]
R81  33K  R-US_0207/10  [0207/10]
R82  33K  R-US_0207/10  [0207/10]
R83  33K  R-US_0207/10  [0207/10]
R84  33K  R-US_0207/10  [0207/10]

### Nets
+8V [Supply]: I1.B I2.B I3.B I4.B I5.B I6.B I7.B I8.B I9.B I10.B I11.B I12.B ; also sheet 1,2
BK_DATA_CONT: D80.A ; also sheet 1
BREAK_C: D84.A U$2.BL2
BRK_INP: D83.A U$2.BE2
D: D74.A U$2.DK2
DATA00: D61.A ; also sheet 1
DATA01: D62.A ; also sheet 1
DATA02: D63.A ; also sheet 1
DATA03: D64.A ; also sheet 1
DATA04: D65.A ; also sheet 1
DATA05: D66.A ; also sheet 1
DATA06: D67.A ; also sheet 1
DATA07: D68.A ; also sheet 1
DATA08: D69.A ; also sheet 1
DATA09: D70.A ; also sheet 1
DATA10: D71.A ; also sheet 1
DATA11: D72.A ; also sheet 1
DATA_EN: R62.2 R64.2 R66.2 R68.2 R70.2 R72.2 R74.2 R76.2 R78.2 R80.2 R82.2 R84.2 ; also sheet 2
E: D75.A U$2.DL2
FETCH: D73.A ; also sheet 1
GND [Supply]: Q1.1(E) Q2.1(E) Q3.1(E) Q4.1(E) Q5.1(E) Q6.1(E) Q7.1(E) Q8.1(E) Q9.1(E) Q10.1(E) Q11.1(E) Q12.1(E) R25.1 R28.1 R31.1 R34.1 R37.1 R40.1 R43.1 R46.1 R49.1 R52.1 R55.1 R58.1 ; also sheet 1,2
I/O_PAUSE: D82.A U$2.CD1
INDSTROBE: E18.4(A:I0) E18.6(B:I0) E18.10(C:I1) E18.12(D:I1) E22.4(A:I0) E22.6(B:I0) E22.10(C:I1) E22.12(D:I1) E26.4(A:I0) E26.6(B:I0) E26.10(C:I1) E26.12(D:I1) ; also sheet 2
IR0: D76.A ; also sheet 1
IR1: D77.A ; also sheet 1
IR2: D78.A ; also sheet 1
MD00: D49.A U$2.AK1
MD01: D50.A U$2.AL1
MD02: D51.A U$2.AM1
MD03: D52.A ; also sheet 1
MD04: D53.A U$2.BK1
MD05: D54.A U$2.BL1
MD06: D55.A U$2.BM1
MD07: D56.A U$2.BP1
MD08: D57.A U$2.DK1
MD09: D58.A ; also sheet 1
MD10: D59.A U$2.DM1
MD11: D60.A ; also sheet 1
MD_DIR_IN: D79.A ; also sheet 1
MD_EN: R13.1 R14.1 R15.1 R16.1 R17.1 R18.1 R19.1 R20.1 R21.1 R22.1 R23.1 R24.1 ; also sheet 2
N$53: E26.3(A:O) R26.1 R27.1
N$73: D1.A R26.2
N$76: C1.2 D1.C Q1.2(B) R27.2
N$77: C1.1 I1.A Q1.3(C) R25.2
N$78: E26.2(B:O) R29.1 R30.1
N$79: D2.A R29.2
N$80: C2.2 D2.C Q2.2(B) R30.2
N$81: C2.1 I2.A Q2.3(C) R28.2
N$82: E26.13(D:O) R32.1 R33.1
N$83: D3.A R32.2
N$84: C3.2 D3.C Q3.2(B) R33.2
N$85: C3.1 I3.A Q3.3(C) R31.2
N$86: E26.14(C:O) R35.1 R36.1
N$87: D4.A R35.2
N$88: C4.2 D4.C Q4.2(B) R36.2
N$89: C4.1 I4.A Q4.3(C) R34.2
N$90: E22.3(A:O) R38.1 R39.1
N$91: D5.A R38.2
N$92: C5.2 D5.C Q5.2(B) R39.2
N$93: C5.1 I5.A Q5.3(C) R37.2
N$94: E22.2(B:O) R41.1 R42.1
N$95: D6.A R41.2
N$96: C6.2 D6.C Q6.2(B) R42.2
N$97: C6.1 I6.A Q6.3(C) R40.2
N$98: E22.13(D:O) R44.1 R45.1
N$99: D7.A R44.2
N$100: C7.2 D7.C Q7.2(B) R45.2
N$101: C7.1 I7.A Q7.3(C) R43.2
N$102: E22.14(C:O) R47.1 R48.1
N$103: D8.A R47.2
N$104: C8.2 D8.C Q8.2(B) R48.2
N$105: C8.1 I8.A Q8.3(C) R46.2
N$106: E18.3(A:O) R50.1 R51.1
N$107: D9.A R50.2
N$108: C9.2 D9.C Q9.2(B) R51.2
N$109: C9.1 I9.A Q9.3(C) R49.2
N$110: E18.2(B:O) R53.1 R54.1
N$111: D10.A R53.2
N$112: C10.2 D10.C Q10.2(B) R54.2
N$113: C10.1 I10.A Q10.3(C) R52.2
N$114: E18.13(D:O) R56.1 R57.1
N$115: D11.A R56.2
N$116: C11.2 D11.C Q11.2(B) R57.2
N$117: C11.1 I11.A Q11.3(C) R55.2
N$118: E18.14(C:O) R59.1 R60.1
N$119: D12.A R59.2
N$120: C12.2 D12.C Q12.2(B) R60.2
N$121: C12.1 I12.A Q12.3(C) R58.2
N$123: D24.A D36.A D48.A E26.5(A:I1) R1.1
N$124: D23.A D35.A D47.A E26.7(B:I1) R2.1
N$125: D22.A D34.A D46.A E26.11(D:I0) R3.1
N$126: D21.A D33.A D45.A E26.9(C:I0) R4.1
N$127: D20.A D32.A D44.A E22.5(A:I1) R5.1
N$128: D19.A D31.A D43.A E22.7(B:I1) R6.1
N$129: D18.A D30.A D42.A E22.11(D:I0) R7.1
N$130: D17.A D29.A D41.A E22.9(C:I0) R8.1
N$131: D16.A D28.A D40.A E18.5(A:I1) R9.1
N$132: D15.A D27.A D39.A E18.7(B:I1) R10.1
N$133: D14.A D26.A D38.A E18.11(D:I0) R11.1
N$134: D13.A D25.A D37.A E18.9(C:I0) R12.1
N$135: D24.C D49.C R13.2
N$136: D13.C D60.C R24.2
N$137: D14.C D59.C R23.2
N$138: D15.C D58.C R22.2
N$139: D16.C D57.C R21.2
N$140: D17.C D56.C R20.2
N$141: D18.C D55.C R19.2
N$142: D19.C D54.C R18.2
N$143: D23.C D50.C R14.2
N$144: D22.C D51.C R15.2
N$145: D21.C D52.C R16.2
N$146: D20.C D53.C R17.2
N$148: D36.C D61.C R62.1
N$149: D35.C D62.C R64.1
N$150: D34.C D63.C R66.1
N$151: D33.C D64.C R68.1
N$152: D32.C D65.C R70.1
N$153: D31.C D66.C R72.1
N$154: D30.C D67.C R74.1
N$155: D29.C D68.C R76.1
N$156: D28.C D69.C R78.1
N$157: D27.C D70.C R80.1
N$158: D26.C D71.C R82.1
N$159: D25.C D72.C R84.1
N$160: D48.C D73.C R61.1
N$161: D47.C D74.C R63.1
N$162: D46.C D75.C R65.1
N$163: D45.C D76.C R67.1
N$164: D44.C D77.C R69.1
N$165: D43.C D78.C R71.1
N$166: D42.C D79.C R73.1
N$167: D41.C D80.C R75.1
N$168: D40.C D81.C R77.1
N$169: D39.C D82.C R79.1
N$170: D38.C D83.C R81.1
N$171: D37.C D84.C R83.1
STATE_EN: R61.2 R63.2 R65.2 R67.2 R69.2 R71.2 R73.2 R75.2 R77.2 R79.2 R81.2 R83.2 ; also sheet 2
SWITCH: D81.A ; also sheet 1
VCC [Supply]: R1.2 R2.2 R3.2 R4.2 R5.2 R6.2 R7.2 R8.2 R9.2 R10.2 R11.2 R12.2 ; also sheet 1,2

## Power pins joined to a net without a drawn wire
GND: E1.7(P:GND) E2.1(P:GND) E3.7(P:GND) E4.7(P:GND) E5.7(P:GND) E6.7(P:GND) E7.7(P:GND) E8.7(P:GND) E9.7(P:GND) E10.7(P:GND) E11.1(GND) E12.7(P:GND) E13.1(P:GND) E14.7(P:GND) E15.1(GND) E16.1(P:GND) E17.7(P:GND) E18.1(P:GND) E19.7(P:GND) E20.1(P:GND) E21.7(P:GND) E22.1(P:GND) E23.7(P:GND) E24.1(P:GND) E25.7(P:GND) E26.1(P:GND) E27.7(P:GND) E28.1(P:GND)
VCC: E1.14(P:VCC) E2.8(P:VCC) E3.14(P:VCC) E4.14(P:VCC) E5.14(P:VCC) E6.14(P:VCC) E7.14(P:VCC) E8.14(P:VCC) E9.14(P:VCC) E10.14(P:VCC) E11.8(VCC) E12.14(P:VCC) E13.8(P:VCC) E14.14(P:VCC) E15.8(VCC) E16.8(P:VCC) E17.14(P:VCC) E18.8(P:VCC) E19.14(P:VCC) E20.8(P:VCC) E21.14(P:VCC) E22.8(P:VCC) E23.14(P:VCC) E24.8(P:VCC) E25.14(P:VCC) E26.8(P:VCC) E27.14(P:VCC) E28.8(P:VCC)

## Library data of the parts
BLUE YELLOW = dec-con:LUG: Spade Lug
C1-C12 C14 C15 C21-C39 = rcl:C-US: CAPACITOR, American symbol
C13 C16-C20 C40 C41 = dec-con:CPOL-USE20-8AXIAL: A 0.8 inch electrolytic.
D1-D129 = diode:1N4148: DIODE high speed (Philips)
E1 E4 E7 E17 E21 E25 = dec-con:N8881: Quad 2-input NAND gate, open collector
E2 E13 E16 E18 E20 E22 E24 E26 E28 = dec-con:SP380: Quad NOR gate (use 8640)
E3 E6 E12 = 74xx-us:74*00: Quad 2-input NAND gate
E5 E8 = 74xx-us:74*10: Triple 3-input NAND gate
E9 E10 = 74xx-us:74*04: Hex INVERTER
E11 = dec-con:SP384: Quad OR gate
E14 = 74xx-us:74*20: Dual 4-input NAND gate
E15 = dec-con:SP314: 7-Input NOR gate
E19 E23 E27 = 74xx-us:74*16: Hex INVERTER, open collector, high-voltage
I1-I28 = dec-con:BULB: T 1 3/4 Bulb
Q1-Q12 Q17-Q19 = transistor-npn:2N3019: NPN Transistor
Q13-Q16 = transistor-pnp:2N3637*: PNP Transistror
R1-R175 = rcl:R-US_: RESISTOR, American symbol
S1 = dec-con:ROTARY8E: Rotary Reed Switch, as used in early 8/E bulb panels.
S2 S9-S22 = dec-con:DPDT8I: DPDT switch as used in 8/i.
S3-S8 = dec-con:SPDT8I: SPDT Momentary, as used in 8/i.
U$2 = dec-con:QUAD: Quad-Height DEC board

## Net classes
1 Supply: width 0.813 mm